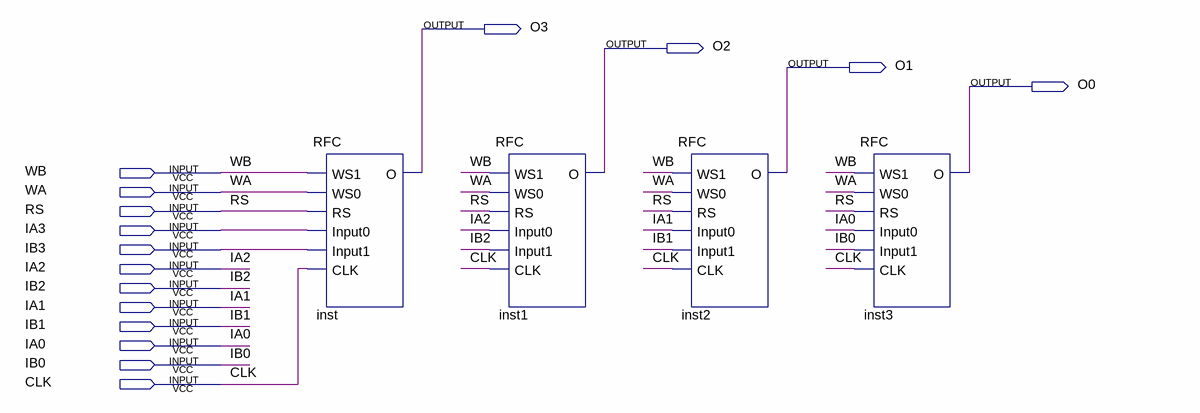
[diagram p0: schematic sheet]
// Quartus schematic Word.bdf as structural Verilog: 4 symbols, 16 pins
module Word (
  input  WB,
  input  WA,
  input  RS,
  input  IA3,
  input  IB3,
  input  IA2,
  input  IB2,
  input  IA1,
  input  IB1,
  input  IA0,
  input  IB0,
  input  CLK,
  output O3,
  output O2,
  output O1,
  output O0
);

  RFC inst (.WS1(WB), .WS0(WA), .RS(RS), .Input0(IA3), .Input1(IB3), .CLK(CLK), .O(O3));
  RFC inst1 (.WS1(WB), .WS0(WA), .RS(RS), .Input0(IA2), .Input1(IB2), .CLK(CLK), .O(O2));
  RFC inst2 (.WS1(WB), .WS0(WA), .RS(RS), .Input0(IA1), .Input1(IB1), .CLK(CLK), .O(O1));
  RFC inst3 (.WS1(WB), .WS0(WA), .RS(RS), .Input0(IA0), .Input1(IB0), .CLK(CLK), .O(O0));
endmodule
